# EAGLE design sd card spi FRAM (EAGLE 9.6.2)
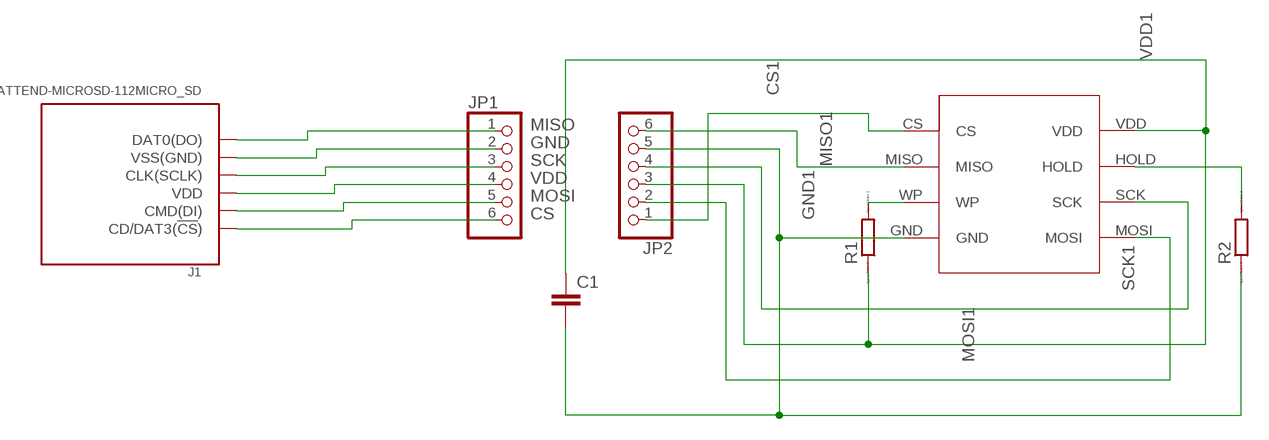
[diagram p0: schematic, sheet 1]

## Parts
C1  C5/5  [C5B5]
J1  ATTEND-MICROSD-112MICRO_SD  [MICROSD_MICROSD_CARD]
JP1  PINHD-1X6  [1X06]
JP2  PINHD-1X6  [1X06]
R1  R-EU_0207_10  [0207/10]
R2  R-EU_0207_10  [0207/10]
U$1  MB85RS  [SOIC8]

## Nets
CS: J1.2(CD/DAT3(!CS!)) JP1.6
CS1: JP2.1 U$1.CS
GND: J1.6(VSS(GND)) JP1.2
GND1: C1.2 JP2.5 R2.1 U$1.GND
MISO: J1.7(DAT0(DO)) JP1.1
MISO1: JP2.6 U$1.MISO
MOSI: J1.3(CMD(DI)) JP1.5
MOSI1: JP2.2 U$1.MOSI
N$8: R1.2 U$1.WP
N$9: R2.2 U$1.HOLD
SCK: J1.5(CLK(SCLK)) JP1.3
SCK1: JP2.4 U$1.SCK
VDD: J1.4(VDD) JP1.4
VDD1: C1.1 JP2.3 R1.1 U$1.VDD

## Library data of the parts
C1 = capacitor-wima:C: CAPACITOR naming: grid - package width
J1 = SdCard:ATTEND-MICROSD-112: Attend microSD socket Datasheet: Attend 112 microSD socket <http://www.soselectronic.com/a_info/resource/f/112I-TXAR-R_B_1.pdf>.
JP1 JP2 = pinhead:PINHD-1X6: PIN HEADER
R1 R2 = resistor:R-EU_: RESISTOR, European symbol; SPICEPREFIX: R
U$1 = MB85RS:MB85RS

## Net classes
0 default: clearance 0.205 mm

## Board
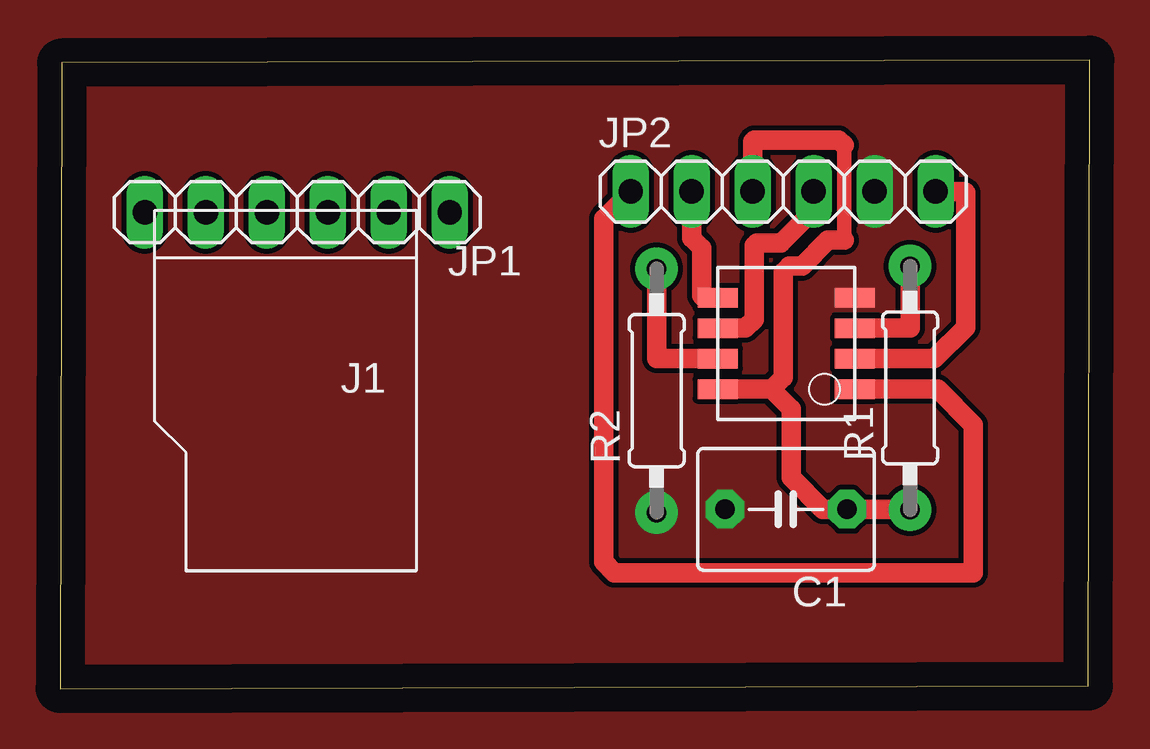
[diagram p1: board, top side]
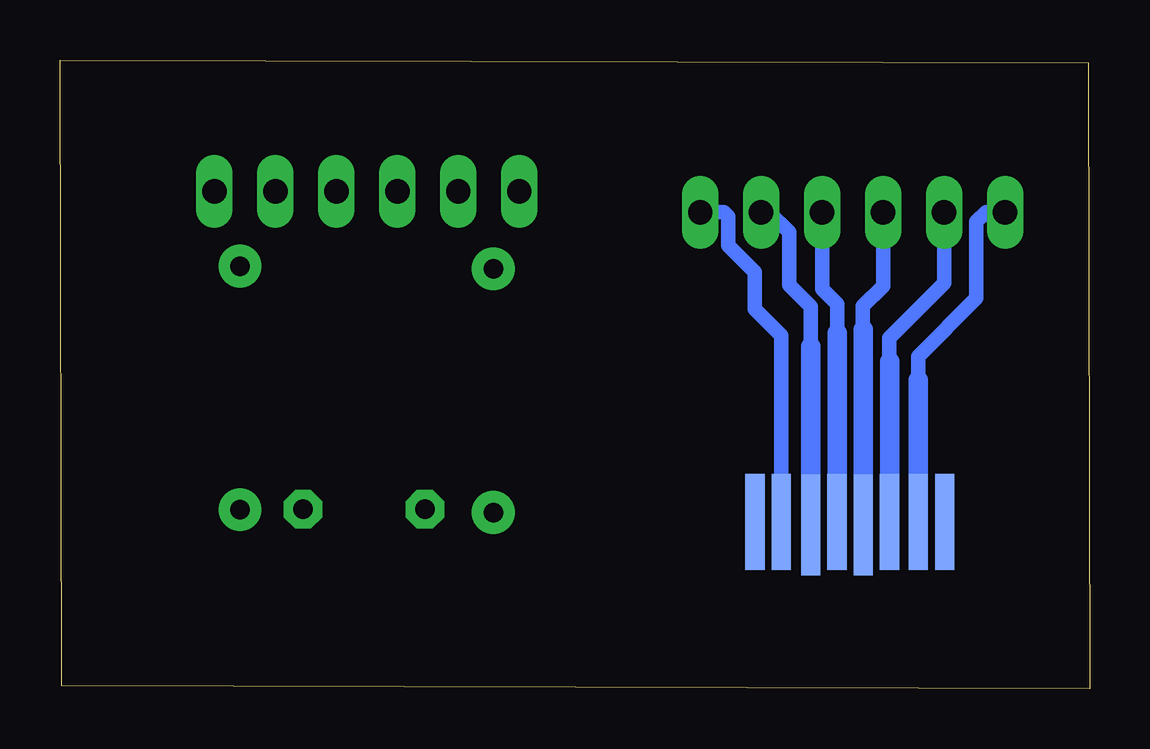
[diagram p2: board, bottom side, seen from below]

Size 42.92 x 26.22 mm. Coordinates in mm from the lower left corner, seen from the top.
Outline: 0,0 42.85,0.12 42.92,26.22 0.07,26.1 0,0
Copper layers (1*16): Top 0.035mm / dielectric 1.5mm / Bottom 0.035mm
Design rules "sd card spi FRAM": minimum track width 6mil, minimum drill 0.35mm, track to track 0.205mm, track to pad 0.205mm, pad to pad 0.205mm, via to via 0.205mm, smd to smd 6mil, copper to edge 40mil, drill to drill 6mil, minimum pad ring 10mil, minimum via ring 8mil, stop-mask expansion 4mil, vias tented up to drill 0mil, thermal gap 10mil

### Footprints (pad centres in the part's own frame; a part is rotated, then mirrored left to right if it is on the bottom)
C5B5 = drill 0.813 pad 1.6 octagon: 1 -2.54,0; 2 2.54,0
MICROSD_MICROSD_CARD = smd 0.8 x 4 bottom: 1 8.8,13.002; 2 7.7,12.991; 3 6.501,13.002; 5 4.312,13.002; 7 1.991,13.002; 8 0.891,13.002 | smd 0.8 x 4.2 bottom: 4 5.401,13.112; 6 3.212,13.112
1X06 = drill 1.016 long: 1 -6.35,0; 2 -3.81,0; 3 -1.27,0; 4 1.27,0; 5 3.81,0; 6 6.35,0
0207/10 = drill 0.813 pad 1.778: 1 -5.08,0; 2 5.08,0
SOIC8 = smd 1.676 x 0.813: CS -2.54,-1.27; GND -2.54,-5.08; HOLD 3.175,-2.54; MISO -2.54,-2.54; MOSI 3.175,-5.08; SCK 3.175,-3.81; VDD 3.175,-1.27; WP -2.54,-3.81

### Placement (x,y rotation side)
C1  30.25,7.48 180 top
J1  14.85,19.95 180 top
JP1  9.89,19.87 180 top
JP2  30.13,20.73 0 top
R1  35.42,12.54 90 top
R2  24.86,12.43 90 top
U$1  30.58,11.22 180 top

### Tracks (layer width: path | path; a pad name or v marks a point on that pad's centre or on a via)
CS
  Bottom 0.61: JP1.6 4.33,19.87 4.73,19.47 4.73,16.28 7.15,13.86 7.15,12.87
  Bottom 0.813: 7.15,12.87 J1.2
CS1
  Top 0.813: JP2.1 22.66,19.61 22.66,5.28 23.1,4.84 38.06,4.84 38.06,11 36.57,12.49 U$1.CS
GND
  Bottom 0.61: 11.64,14.28 11.64,15.93 12.54,16.83 12.54,19.03 13.38,19.87 JP1.2
  Bottom 0.813: J1.6 11.64,14.28
GND1
  pour Top (isolate 0.254, no thermals): 20.13,24.53 40.81,24.53 40.81,3.3 20.13,3.3
MISO
  Bottom 0.61: JP1.1 15.25,19.87 15.07,19.69 15.07,18.48 13.97,17.38 13.97,15.84 12.86,14.73 J1.7
MISO1
  Top 0.813: U$1.MISO 36.42,13.76 37.73,15.07 37.73,20.68 37.68,20.73 JP2.6
MOSI
  Bottom 0.61: JP1.5 6.08,16.91 8.36,14.63 8.36,13.66 8.35,13.65
  Bottom 0.813: 8.35,13.65 J1.3
MOSI1
  Top 0.813: JP2.2 26.32,18.78 26.73,18.37 26.73,16.39 26.82,16.3 U$1.MOSI
N$8
  Top 0.813: U$1.WP 35.42,15.03 R1.2
N$9
  Top 0.813: U$1.HOLD 24.86,13.76 R2.2
SCK
  Bottom 0.61: 10.54,14.83 10.54,16.04 11.16,16.66 JP1.3
  Bottom 0.813: J1.5 10.54,14.83
SCK1
  Top 0.813: U$1.SCK 28.56,15.03 28.93,15.4 28.93,18.48 29.04,18.59 30.03,18.59 31.4,19.96 JP2.4
VDD
  Bottom 0.61: JP1.4 8.62,16.79 9.46,15.95 9.46,14.98 9.45,14.97
  Bottom 0.813: 9.45,14.97 J1.4
VDD1
  Top 0.61: 32.67,18.7 32.67,22.66 | 29.64,12.49 29.65,12.49
  Top 0.813: U$1.VDD 29.64,12.49 30.47,11.66 30.47,8.8 31.79,7.48 C1.1 35.4,7.48 R1.1 | JP2.3 28.86,22.81 28.93,22.88 32.45,22.88 32.67,22.66 | 29.65,12.49 30.14,12.98 30.14,17.38 30.39,17.62 30.93,17.62 32,18.7 32.67,18.7
~_REAL_OUTLINEMILL_~
  pour Top (no thermals): -5.02,-5.02 105.02,-5.02 105.02,85.02 -5.02,85.02